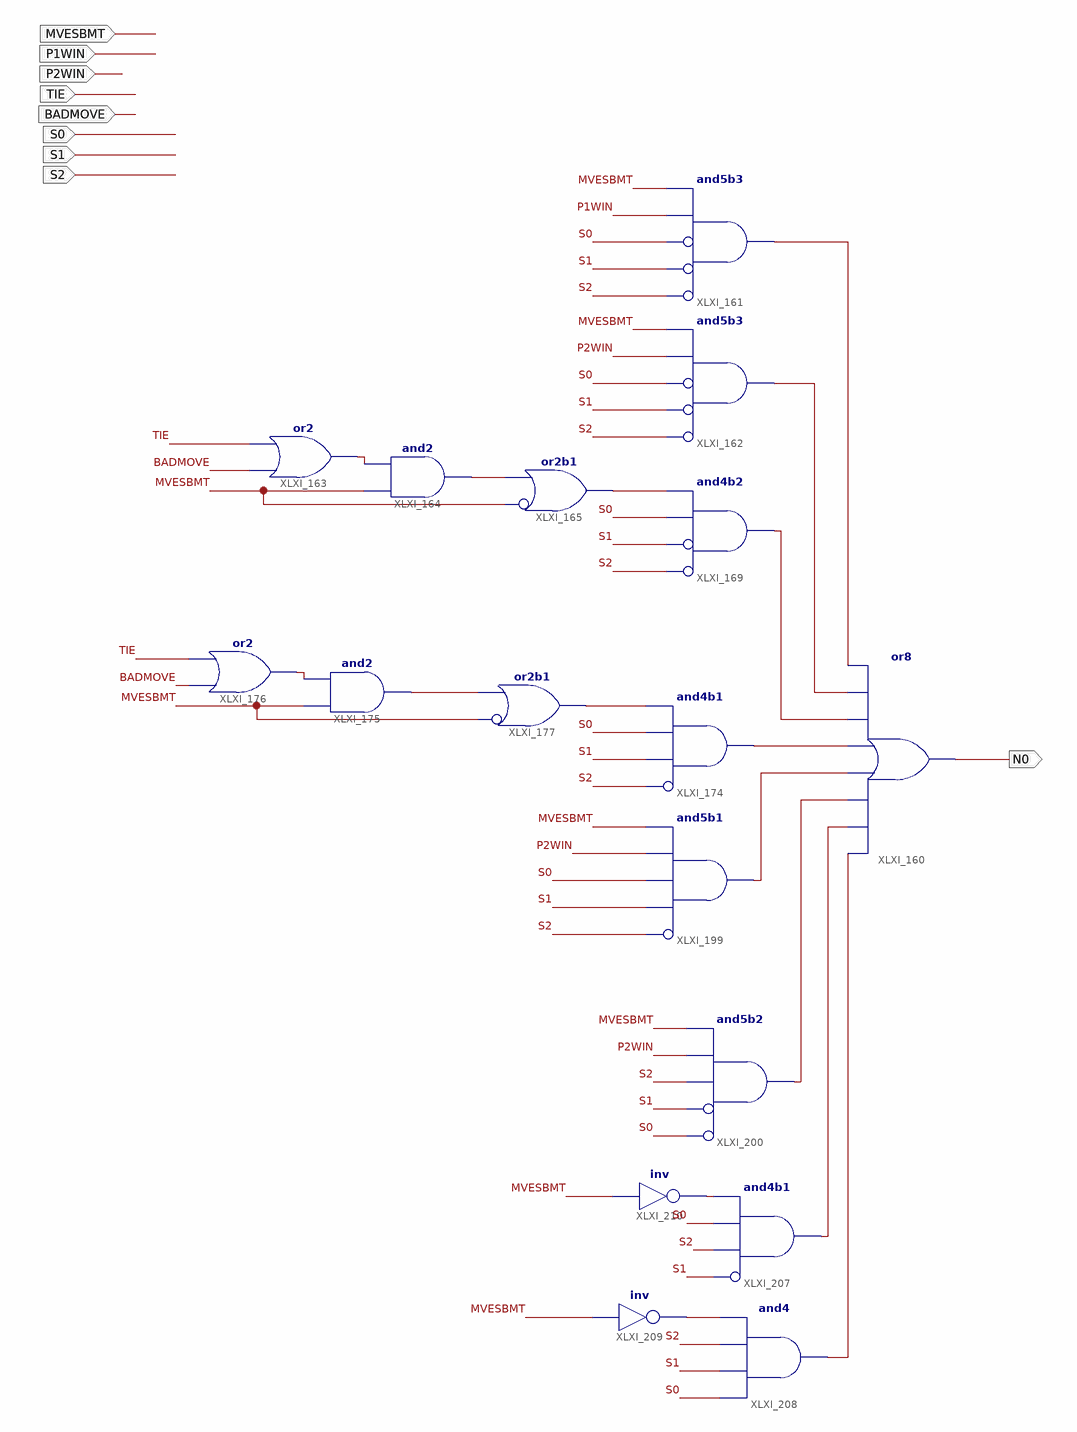
[diagram p0: schematic sheet 1]
// Xilinx ISE schematic N0Logic.sch (spartan6) as structural Verilog: 17 symbols, 9 ports
module N0Logic (
  input  P2WIN,
  input  P1WIN,
  input  MVESBMT,
  input  BADMOVE,
  input  TIE,
  input  S0,
  input  S1,
  input  S2,
  output N0
);

  wire XLXN_503, XLXN_504, XLXN_536, XLXN_580, XLXN_581, XLXN_640, XLXN_711, XLXN_712, XLXN_721, XLXN_722,
       XLXN_723, XLXN_724, XLXN_725, XLXN_726, XLXN_728, XLXN_729;

  and XLXI_199 (XLXN_725, ~S2, S1, S0, P2WIN, MVESBMT);  // and5b1
  and XLXI_174 (XLXN_724, ~S2, S1, S0, XLXN_640);  // and4b1
  or XLXI_177 (XLXN_640, ~MVESBMT, XLXN_581);  // or2b1
  and XLXI_175 (XLXN_581, MVESBMT, XLXN_580);
  or XLXI_176 (XLXN_580, BADMOVE, TIE);
  and XLXI_169 (XLXN_723, ~S2, ~S1, S0, XLXN_536);  // and4b2
  or XLXI_163 (XLXN_503, BADMOVE, TIE);
  and XLXI_164 (XLXN_504, MVESBMT, XLXN_503);
  or XLXI_165 (XLXN_536, ~MVESBMT, XLXN_504);  // or2b1
  not XLXI_209 (XLXN_712, MVESBMT);
  not XLXI_210 (XLXN_711, MVESBMT);
  and XLXI_207 (XLXN_728, ~S1, S2, S0, XLXN_711);  // and4b1
  and XLXI_200 (XLXN_726, ~S0, ~S1, S2, P2WIN, MVESBMT);  // and5b2
  and XLXI_208 (XLXN_729, S0, S1, S2, XLXN_712);
  or XLXI_160 (N0, XLXN_729, XLXN_728, XLXN_726, XLXN_725, XLXN_724, XLXN_723, XLXN_722, XLXN_721);
  and XLXI_162 (XLXN_722, ~S2, ~S1, ~S0, P2WIN, MVESBMT);  // and5b3
  and XLXI_161 (XLXN_721, ~S2, ~S1, ~S0, P1WIN, MVESBMT);  // and5b3
endmodule
